# Altium schematic sheet 8-Bluetooth.SchDoc
size A4
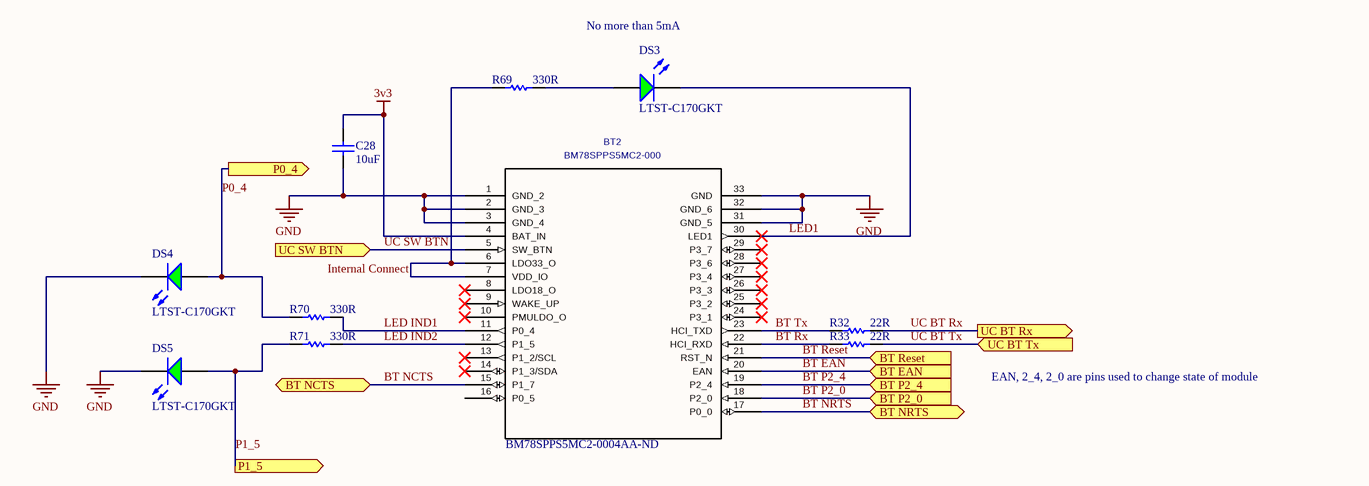
[diagram p0: 8-Bluetooth.SchDoc]

## Parts
BT2  BM78SPPS5MC2-000  Supplier Part Number 1: BM78SPPS5MC2-0004AA-ND  [BM78SPPS5MC2/NC2]
C28  value 10uF  [1608[0603]]  (hidden comment: Cap)
DS3  LTST-C170GKT  [LTST-C170GKT_V]
DS4  LTST-C170GKT  [LTST-C170GKT_V]
DS5  LTST-C170GKT  [LTST-C170GKT_V]
R32  value 22R  [1608[0603]]  (hidden comment: Res1)
R33  value 22R  [1608[0603]]  (hidden comment: Res1)
R69  value 330R  [1608[0603]]  (hidden comment: Res1)
R70  value 330R  [1608[0603]]  (hidden comment: Res1)
R71  value 330R  [1608[0603]]  (hidden comment: Res1)

## Ports
BT EAN (in), BT NCTS (bidir), BT NRTS (bidir), BT P2_0 (in), BT P2_4 (in), BT Reset (in), P0_4 (out), P1_5 (out), UC BT Rx (out), UC BT Tx (in), UC SW BTN (in)

## Nets
3v3: BT2.4(BAT_IN) C28.2
GND: BT2.1(GND_2) BT2.2(GND_3) BT2.3(GND_4) BT2.31(GND_5) BT2.32(GND_6) BT2.33(GND) C28.1 DS4.2(K) DS5.2(K)
BT EAN: BT2.20(EAN) ; port BT EAN
BT NCTS: BT2.15(P1_7) ; port BT NCTS
BT NRTS: BT2.17(P0_0) ; port BT NRTS
BT P2_0: BT2.18(P2_0) ; port BT P2_0
BT P2_4: BT2.19(P2_4) ; port BT P2_4
BT Reset: BT2.21(RST_N) ; port BT Reset
BT Rx: BT2.22(HCI_RXD) R33.1
BT Tx: BT2.23(HCI_TXD) R32.1
Internal Connect: BT2.6(LDO33_O) BT2.7(VDD_IO) R69.1
LED1: BT2.30(LED1) DS3.2(K)
LED IND1: BT2.11(P0_4) R70.2
LED IND2: BT2.12(P1_5) R71.2
P0_4: DS4.1(A) R70.1 ; port P0_4
P1_5: DS5.1(A) R71.1 ; port P1_5
UC BT Rx: R32.2 ; port UC BT Rx
UC BT Tx: R33.2 ; port UC BT Tx
UC SW BTN: BT2.5(SW_BTN) ; port UC SW BTN
NetDS3_1: DS3.1(A) R69.2

Not connected (* = marked no-connect by the designer): BT2 8(LDO18_O)* 9(WAKE_UP)* 10(PMULDO_O)* 13(P1_2/SCL)* 14(P1_3/SDA)* 16(P0_5) 24(P3_1)* 25(P3_2)* 26(P3_3)* 27(P3_4)* 28(P3_6)* 29(P3_7)*

## Notes on the sheet
- No more than 5mA
- EAN, 2_4, 2_0 are pins used to change state of module

## Library data of the parts
BT2 = BM78SPPS5MC2-000: Mfr_Name: Microchip; Manufacturer_Part_Number: BM78SPPS5MC2-0006AA; C: Copyright (C) 2021 Accelerated Designs. All rights reserved; Value: BM78SPPS5MC2-000; Copyright: Copyright (C) 2022 Ultra Librarian. All rights reserved.; Digi-Key_Part_Number_1: 150-BM78SPPS5MC2-0006AA-ND; Supplier 1: Digi-Key
C28 = Cap: Capacitor; Manufacturer: Yageo; Manufacturer Part Number: CC0603KRX7R9BB104; Capacitance: 0.10µF; Tolerance: ±10%; Voltage - Rated: 50V; Temperature Coefficient: X7R; Supplier 1: Digi-Key; Supplier Part Number 1: 311-1344-1-ND; RoHS: RoHS Compliant; Category: Capacitors; Stock 1: 4016262; Pricing 1: 1=0.15, 10=0.043, 25=0.0312, 50=0.0232, 100=0.0189, 250=0.0158, 500=0.01346, 1000=0.01059 (CAD); Packaging: Cut Tape (CT); Part Status: Active; Operating Temperature: -55°C ~ 125°C; Features: -; Ratings: -; Applications: General Purpose; Failure Rate: -; Mounting Type: Surface Mount, MLCC; Package / Case: 0603 (1608 Metric); Size / Dimension: 0.063" L x 0.031" W (1.60mm x 0.80mm); Height - Seated (Max): -; Thickness (Max): 0.035" (0.90mm); Lead Spacing: -; Lead Style: -; ComponentLink1URL: http://www.yageo.com/documents/recent/UPY-GPHC_X7R_6.3V-to-50V_16.pdf; ComponentLink1Description: http://www.yageo.com/documents/recent/UPY-GPHC_X7R_6.3V-to-50V_16.pdf
DS3-DS5 = CMP-1674-00002-5: LED Uni-Color Green, 100 mW, 120 mA, -55 to 85 degC, 2-Pin SMD, RoHS, Tape and Reel; Manufacturer: Lite-On; Lens Color: Colorless; Lens Transparency: Clear; Millicandela Rating: 6mcd; Lens Style/Size: Rectangle with Flat Top, 1.40mm x 1.25mm; Voltage - Forward (Vf) (Typ): 2.1V; Current - Test: 10mA; Viewing Angle: 130°; Wavelength - Dominant: 569nm; Wavelength - Peak: 565nm; ComponentLink1URL: http://www.us.liteon.com/; Height: 1.1 mm; PackageDescription: 2-Pin Surface Mount Device, Body 2 x 1.25 mm; RoHSCompliant: true; Package Quantity: 1; Packaging: Tape and Reel; Mount: Surface Mount; Min Operating Temperature: -55 degC; DatasheetVersion: 03/2003; Max Operating Temperature: 85 degC; ComponentLink1Description: Manufacturer URL; Pins: 2; Mounting Technology: Surface Mount; Length: 2 mm; Colour: Green; PackageReference: C170GKT; ComponentLink2URL: http://media.digikey.com/pdf/Data%20Sheets/Lite-On%20PDFs/LTST-C170GKT.pdf; ComponentLink2Description: Datasheet; Supplier 1: Digi-Key; Supplier Part Number 1: 160-1179-1-ND; Manufacturer Part Number: LTST-C170GKT; RoHS: RoHS Compliant; Category: Optoelectronics; Stock 1: 242288; Pricing 1: 1=0.48, 10=0.351, 25=0.2588, 100=0.1848, 250=0.12564, 500=0.11086, 1000=0.08684 (CAD); Part Status: Active; Color: Green; Mounting Type: Surface Mount; Features: -; Package / Case: 0805 (2012 Metric); Supplier Device Package: -; Size / Dimension: 2.00mm L x 1.25mm W; Height (Max): 1.10mm
R32 R33 R69-R71 = Res1: Resistor; Manufacturer: Yageo; Manufacturer Part Number: RC0603JR-0722RL; Resistance (Ohms): 22; Tolerance: ±5%; Power (Watts): 0.1W, 1/10W; Temperature Coefficient: ±100ppm/°C; Supplier 1: Digi-Key; Supplier Part Number 1: 311-22GRCT-ND; RoHS: RoHS Compliant; Category: Resistors; Stock 1: 603781; Pricing 1: 1=0.16, 10=0.016, 25=0.0112, 50=0.0084, 100=0.0062, 250=0.0048, 500=0.00382, 1000=0.00281 (CAD); Packaging: Cut Tape (CT); Part Status: Active; Composition: Thick Film; Features: Moisture Resistant; Operating Temperature: -55°C ~ 155°C; Package / Case: 0603 (1608 Metric); Supplier Device Package: 0603; Size / Dimension: 0.063" L x 0.031" W (1.60mm x 0.80mm); Height - Seated (Max): 0.022" (0.55mm); Number of Terminations: 2; Failure Rate: -; ComponentLink1URL: http://www.yageo.com/NewPortal/yageodocoutput?fileName=/pdf/R-Chip/PYu-RC_Group_51_RoHS_L_4.pdf; ComponentLink1Description: http://www.yageo.com/NewPortal/yageodocoutput?fileName=/pdf/R-Chip/PYu-RC_Group_51_RoHS_L_4.pdf